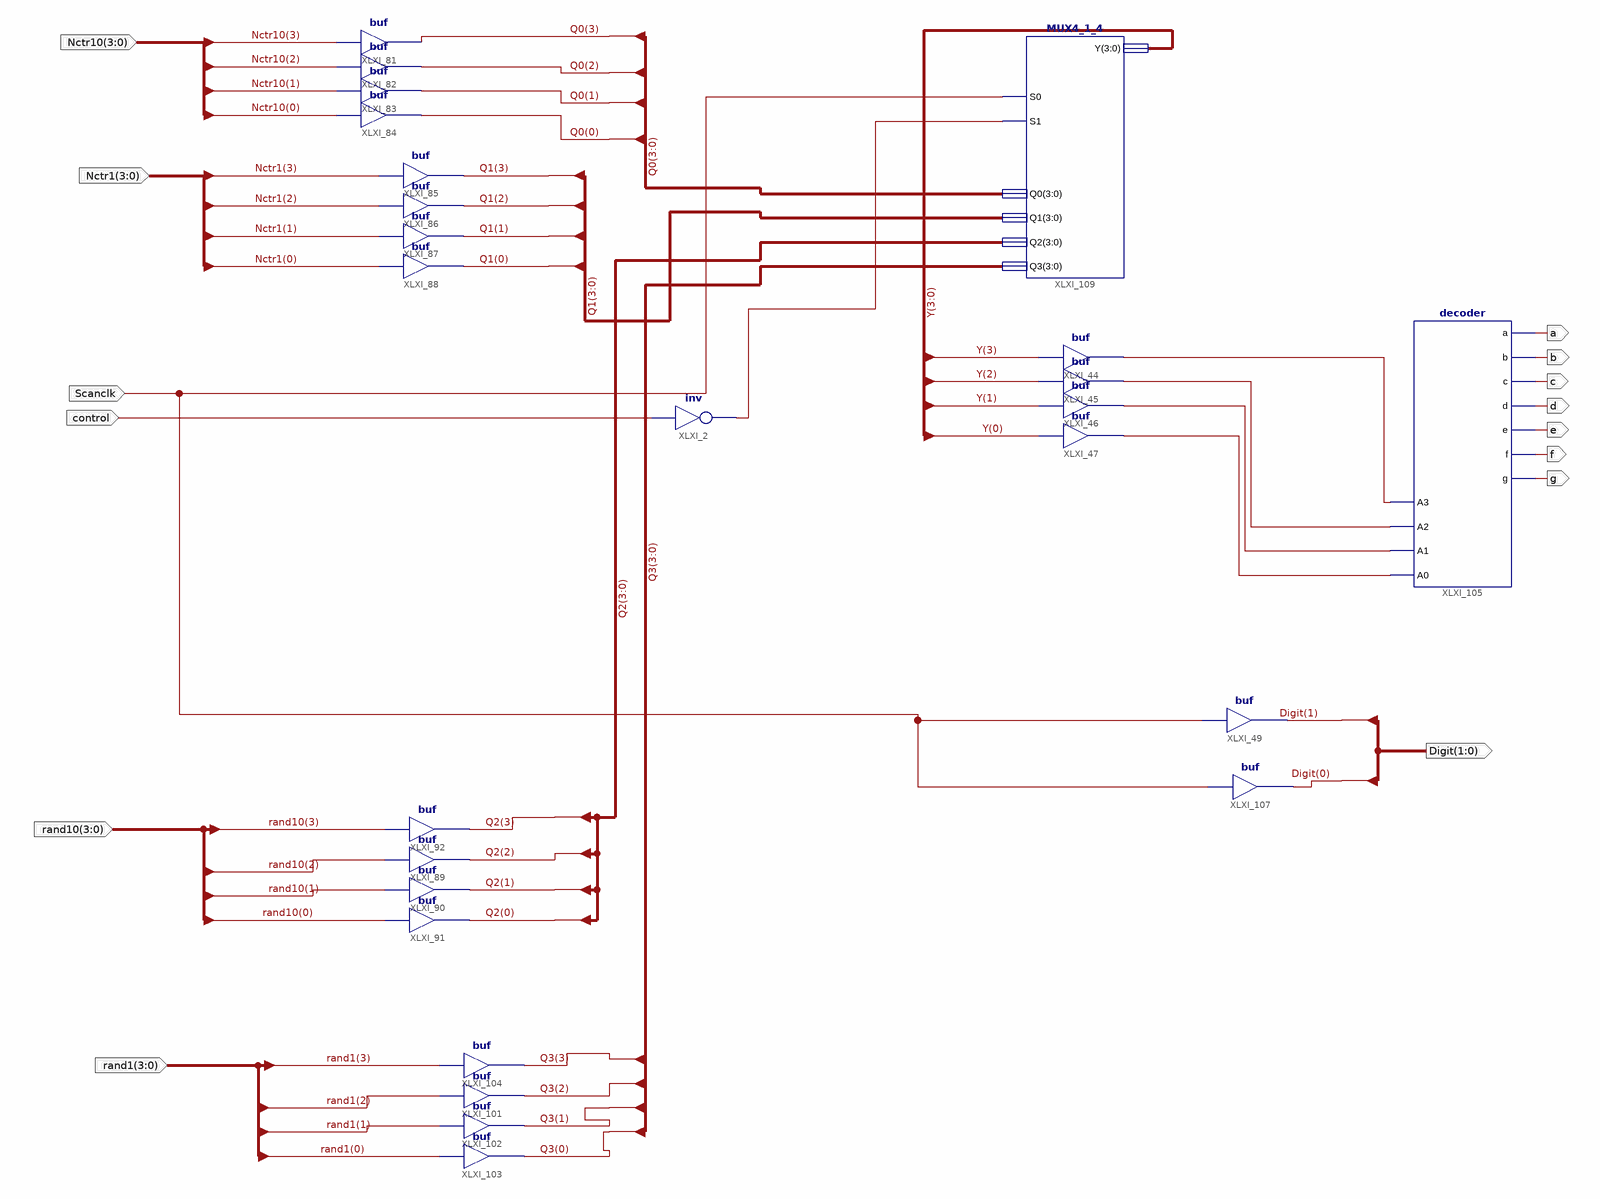
[diagram p0: schematic sheet 1]
// Xilinx ISE schematic DisplayRandomCir.sch (spartan6) as structural Verilog: 25 symbols, 14 ports
module DisplayRandomCir (
  input  Scanclk,
  input  control,
  input  [3:0] Nctr10,
  input  [3:0] Nctr1,
  input  [3:0] rand10,
  input  [3:0] rand1,
  output [1:0] Digit,
  output g,
  output f,
  output e,
  output d,
  output c,
  output b,
  output a
);

  wire XLXN_44, XLXN_45, XLXN_46, XLXN_47, XLXN_218;
  wire [3:0] Q0, Q1, Q2, Q3, Y;

  buf XLXI_49 (Digit[1], Scanclk);
  buf XLXI_44 (XLXN_44, Y[3]);
  buf XLXI_45 (XLXN_45, Y[2]);
  buf XLXI_46 (XLXN_46, Y[1]);
  buf XLXI_47 (XLXN_47, Y[0]);
  buf XLXI_81 (Q0[3], Nctr10[3]);
  buf XLXI_82 (Q0[2], Nctr10[2]);
  buf XLXI_83 (Q0[1], Nctr10[1]);
  buf XLXI_84 (Q0[0], Nctr10[0]);
  buf XLXI_85 (Q1[3], Nctr1[3]);
  buf XLXI_86 (Q1[2], Nctr1[2]);
  buf XLXI_87 (Q1[1], Nctr1[1]);
  buf XLXI_88 (Q1[0], Nctr1[0]);
  buf XLXI_89 (Q2[2], rand10[2]);
  buf XLXI_90 (Q2[1], rand10[1]);
  buf XLXI_91 (Q2[0], rand10[0]);
  buf XLXI_92 (Q2[3], rand10[3]);
  buf XLXI_101 (Q3[2], rand1[2]);
  buf XLXI_102 (Q3[1], rand1[1]);
  buf XLXI_103 (Q3[0], rand1[0]);
  buf XLXI_104 (Q3[3], rand1[3]);
  decoder XLXI_105 (
    .A3(XLXN_44), .A2(XLXN_45), .A1(XLXN_46), .A0(XLXN_47), .a(a), .b(b), .c(c), .d(d), .e(e), .f(f), .g(g));
  not XLXI_2 (XLXN_218, control);
  buf XLXI_107 (Digit[0], Scanclk);
  MUX4_1_4 XLXI_109 (.Q0(Q0), .Q1(Q1), .S0(Scanclk), .S1(XLXN_218), .Q2(Q2), .Q3(Q3), .Y(Y));
endmodule
